# EAGLE design led_test (EAGLE 6.4)
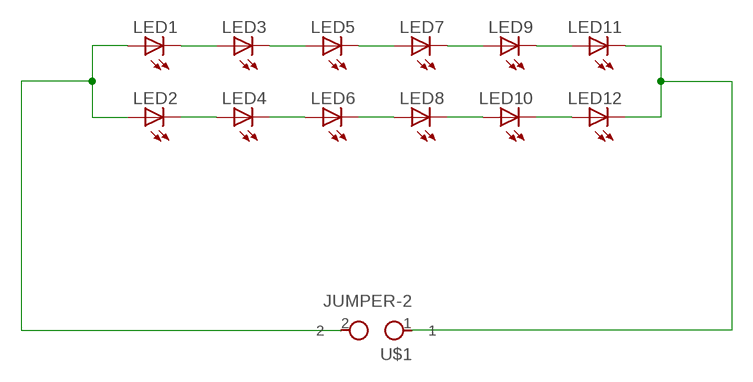
[diagram p0: schematic, sheet 1]

## Parts
LED1  LEDCHIPLED_0603  [CHIPLED_0603]
LED2  LEDCHIPLED_0603  [CHIPLED_0603]
LED3  LEDCHIPLED_0603  [CHIPLED_0603]
LED4  LEDCHIPLED_0603  [CHIPLED_0603]
LED5  LEDCHIPLED_0603  [CHIPLED_0603]
LED6  LEDCHIPLED_0603  [CHIPLED_0603]
LED7  LEDCHIPLED_0603  [CHIPLED_0603]
LED8  LEDCHIPLED_0603  [CHIPLED_0603]
LED9  LEDCHIPLED_0603  [CHIPLED_0603]
LED10  LEDCHIPLED_0603  [CHIPLED_0603]
LED11  LEDCHIPLED_0603  [CHIPLED_0603]
LED12  LEDCHIPLED_0603  [CHIPLED_0603]
U$1  JUMPER-2  [1X02]

## Nets
LED+: LED1.A LED2.A U$1.2
LED-: LED11.C LED12.C U$1.1
N$2: LED1.C LED3.A
N$3: LED3.C LED5.A
N$4: LED5.C LED7.A
N$5: LED7.C LED9.A
N$6: LED9.C LED11.A
N$8: LED10.C LED12.A
N$9: LED8.C LED10.A
N$10: LED6.C LED8.A
N$11: LED4.C LED6.A
N$12: LED2.C LED4.A

## Library data of the parts
LED1-LED12 = adafruit:LED: LED OSRAM: - CHIPLED LG R971, LG N971, LY N971, LG Q971, LY Q971, LO R971, LY R971 LH N974, LH R974 LS Q976, LO Q976, LY Q976 LO Q996 - Hyper CHIPLED LW Q18S LB Q993, LB Q99A, LB R99A - SideLED LS A670, LO A670, LY A670, LG A670, LP A670 LB A673, LV A673, LT A673, LW A673 LH A674 LY A675 LS A676, LA A676, LO A676, LY A676, LW A676 LS A679, LY A679, LG A679 - Hyper Micro SIDELED® LS Y876, LA Y876, LO Y876, LY Y876 LT Y87S - SmartLED LW L88C, LW L88S LB L89C, LB L89S, LG L890 LS L89K, LO L89K, LY L89K LS L896, LA L896, LO L896, LY L896 - TOPLED LS T670, LO T670, LY T670, LG T670, LP T670 LSG T670, LSP T670, LSY T670, LOP T670, LYG T670 LG T671, LOG T671, LSG T671 LB T673, LV T673, LT T673, LW T673 LH T674 LS T676, LA T676, LO T676, LY T676, LB T676, LH T676, LSB T676, LW T676 LB T67C, LV T67C, LT T67C, LS T67K, LO T67K, LY T67K, LW E67C LS E67B, LA E67B, LO E67B, LY E67B, LB E67C, LV E67C, LT E67C LW T67C LS T679, LY T679, LG T679 LS T770, LO T770, LY T770, LG T770, LP T770 LB T773, LV T773, LT T773, LW T773 LH T774 LS E675, LA E675, LY E675, LS T675 LS T776, LA T776, LO T776, LY T776, LB T776 LHGB T686 LT T68C, LB T68C - Hyper Mini TOPLED® LB M676 - Mini TOPLED Santana® LG M470 LS M47K, LO M47K, LY M47K Source: http://www.osram.convergy.de/
U$1 = pinhead:JUMPER-2

## Board
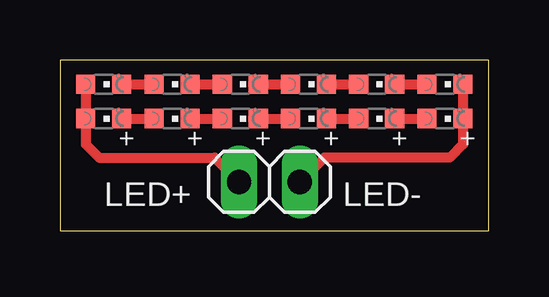
[diagram p1: board, top side]
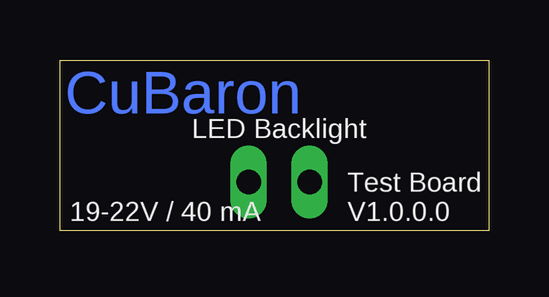
[diagram p2: board, bottom side, seen from below]

Size 17.88 x 7.11 mm. Coordinates in mm from the lower left corner, seen from the top.
Outline: 0,0 17.88,0 17.88,7.11 0,7.11 0,0
Copper layers (1*16): Top 0.035mm / dielectric 1.5mm / Bottom 0.035mm
Design rules "default": minimum track width 10mil, minimum drill 24mil, track to track 8mil, track to pad 8mil, pad to pad 8mil, via to via 8mil, smd to smd 8mil, copper to edge 40mil, drill to drill 8mil, minimum pad ring 10mil, minimum via ring 8mil, stop-mask expansion 4mil, vias tented up to drill 0mil, thermal gap 10mil

### Footprints (pad centres in the part's own frame; a part is rotated, then mirrored left to right if it is on the bottom)
CHIPLED_0603 = smd 0.8 x 0.8: A 0,-0.75; C 0,0.75
1X02 = drill 1.016 long: 1 -1.27,0; 2 1.27,0

### Placement (x,y rotation side)
LED1  1.83,6.1 270 top
LED2  1.83,4.67 270 top
LED3  4.67,6.1 270 top
LED4  4.67,4.67 270 top
LED5  7.52,6.1 270 top
LED6  7.52,4.67 270 top
LED7  10.36,6.1 270 top
LED8  10.36,4.67 270 top
LED9  13.21,6.1 270 top
LED10  13.21,4.67 270 top
LED11  16.05,6.1 270 top
LED12  16.05,4.67 270 top
U$1  8.74,2.03 180 top

### Tracks (layer width: path | path; a pad name or v marks a point on that pad's centre or on a via)
LED+
  Top 0.406: LED1.A LED2.A 1.08,3.59 1.63,3.05 6.45,3.05 U$1.2
LED-
  Top 0.406: LED11.C LED12.C 16.8,3.59 16.26,3.05 11.02,3.05 U$1.1
N$2
  Top 0.406: LED1.C LED3.A
N$3
  Top 0.406: LED3.C LED5.A
N$4
  Top 0.406: LED5.C LED7.A
N$5
  Top 0.406: LED7.C LED9.A
N$6
  Top 0.406: LED9.C LED11.A
N$8
  Top 0.406: LED10.C LED12.A
N$9
  Top 0.406: LED8.C LED10.A
N$10
  Top 0.406: LED6.C LED8.A
N$11
  Top 0.406: LED4.C LED6.A
N$12
  Top 0.406: LED2.C LED4.A

### Text on the board
Bottom: CuBaron
tPlace: + | + | + | + | + | + | LED+ | LED-
bPlace: LED Backlight | Test Board | V1.0.0.0 | 19-22V / 40 mA